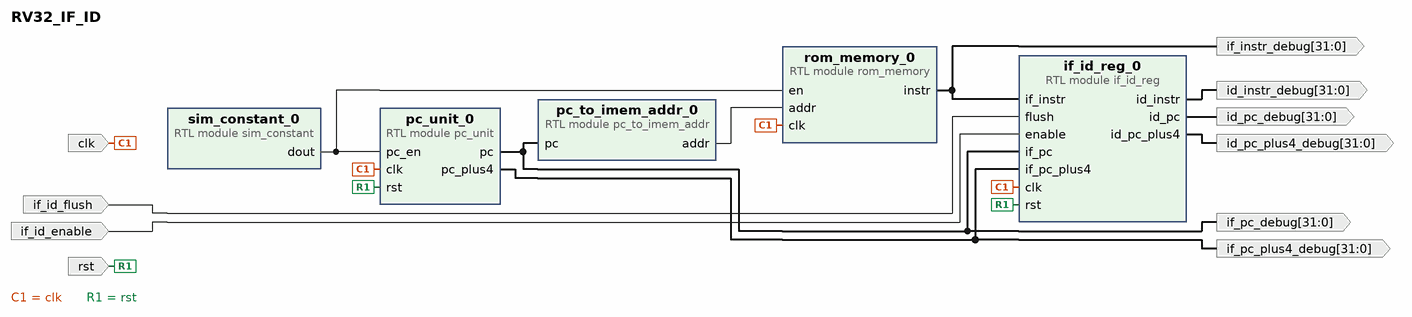
[diagram p0: block diagram of the top level]
# Vivado block design RV32_IF_ID, xczu5ev-sfvc784-2-i, Vivado 2020.1
create_bd_design RV32_IF_ID

create_bd_port -dir I clk
create_bd_port -dir O -from 31 -to 0 if_instr_debug
create_bd_port -dir I -type rst rst
set_property -dict {CONFIG.POLARITY ACTIVE_HIGH} [get_bd_ports rst]
create_bd_port -dir O -from 31 -to 0 id_pc_debug
create_bd_port -dir O -from 31 -to 0 id_pc_plus4_debug
create_bd_port -dir O -from 31 -to 0 id_instr_debug
create_bd_port -dir I if_id_enable
create_bd_port -dir I if_id_flush
create_bd_port -dir O -from 31 -to 0 if_pc_plus4_debug
create_bd_port -dir O -from 31 -to 0 -type data if_pc_debug

create_bd_cell -type module -reference pc_to_imem_addr pc_to_imem_addr_0
create_bd_cell -type module -reference pc_unit pc_unit_0
create_bd_cell -type module -reference rom_memory rom_memory_0
create_bd_cell -type module -reference sim_constant sim_constant_0
set_property -dict {CONFIG.VALUE 1} [get_bd_cells sim_constant_0]
create_bd_cell -type module -reference if_id_reg if_id_reg_0

# ---- connections ----

connect_bd_net [get_bd_ports clk] [get_bd_pins pc_unit_0/clk] [get_bd_pins rom_memory_0/clk] [get_bd_pins if_id_reg_0/clk]
connect_bd_net [get_bd_pins sim_constant_0/dout] [get_bd_pins pc_unit_0/pc_en] [get_bd_pins rom_memory_0/en]
connect_bd_net [get_bd_pins pc_unit_0/pc] [get_bd_pins pc_to_imem_addr_0/pc] [get_bd_pins if_id_reg_0/if_pc] [get_bd_ports if_pc_debug]
connect_bd_net [get_bd_pins rom_memory_0/instr] [get_bd_ports if_instr_debug] [get_bd_pins if_id_reg_0/if_instr]
connect_bd_net [get_bd_ports rst] [get_bd_pins pc_unit_0/rst] [get_bd_pins if_id_reg_0/rst]
connect_bd_net [get_bd_pins pc_unit_0/pc_plus4] [get_bd_pins if_id_reg_0/if_pc_plus4] [get_bd_ports if_pc_plus4_debug]
connect_bd_net [get_bd_pins if_id_reg_0/id_pc] [get_bd_ports id_pc_debug]
connect_bd_net [get_bd_pins if_id_reg_0/id_pc_plus4] [get_bd_ports id_pc_plus4_debug]
connect_bd_net [get_bd_pins if_id_reg_0/id_instr] [get_bd_ports id_instr_debug]
connect_bd_net [get_bd_ports if_id_flush] [get_bd_pins if_id_reg_0/flush]
connect_bd_net [get_bd_pins pc_to_imem_addr_0/addr] [get_bd_pins rom_memory_0/addr]
connect_bd_net [get_bd_ports if_id_enable] [get_bd_pins if_id_reg_0/enable]

validate_bd_design
save_bd_design
